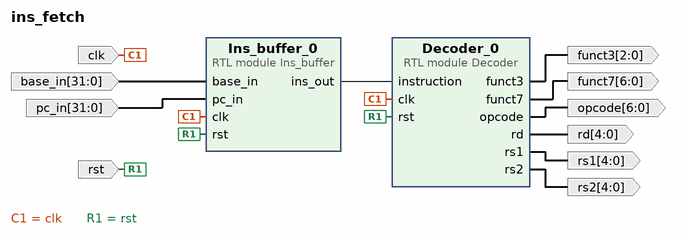
[diagram p0: block diagram of the top level]
# Vivado block design ins_fetch, xc7a100tcsg324-1, Vivado 2022.2
create_bd_design ins_fetch

create_bd_port -dir I clk
create_bd_port -dir I rst
create_bd_port -dir I -from 31 -to 0 pc_in
create_bd_port -dir I -from 31 -to 0 base_in
create_bd_port -dir O -from 6 -to 0 opcode
create_bd_port -dir O -from 4 -to 0 rd
create_bd_port -dir O -from 4 -to 0 rs1
create_bd_port -dir O -from 4 -to 0 rs2
create_bd_port -dir O -from 2 -to 0 funct3
create_bd_port -dir O -from 6 -to 0 funct7

create_bd_cell -type module -reference Decoder Decoder_0
create_bd_cell -type module -reference Ins_buffer Ins_buffer_0

# ---- connections ----

connect_bd_net [get_bd_pins Decoder_0/funct3] [get_bd_ports funct3]
connect_bd_net [get_bd_pins Decoder_0/funct7] [get_bd_ports funct7]
connect_bd_net [get_bd_pins Decoder_0/opcode] [get_bd_ports opcode]
connect_bd_net [get_bd_pins Decoder_0/rd] [get_bd_ports rd]
connect_bd_net [get_bd_pins Decoder_0/rs1] [get_bd_ports rs1]
connect_bd_net [get_bd_pins Decoder_0/rs2] [get_bd_ports rs2]
connect_bd_net [get_bd_pins Ins_buffer_0/ins_out] [get_bd_pins Decoder_0/instruction]
connect_bd_net [get_bd_ports base_in] [get_bd_pins Ins_buffer_0/base_in]
connect_bd_net [get_bd_ports clk] [get_bd_pins Decoder_0/clk] [get_bd_pins Ins_buffer_0/clk]
connect_bd_net [get_bd_ports pc_in] [get_bd_pins Ins_buffer_0/pc_in]
connect_bd_net [get_bd_ports rst] [get_bd_pins Decoder_0/rst] [get_bd_pins Ins_buffer_0/rst]

validate_bd_design
save_bd_design
